# Altium schematic sheet circuit.SchDoc
size A4; SheetNumber: 1; SheetTotal: 2
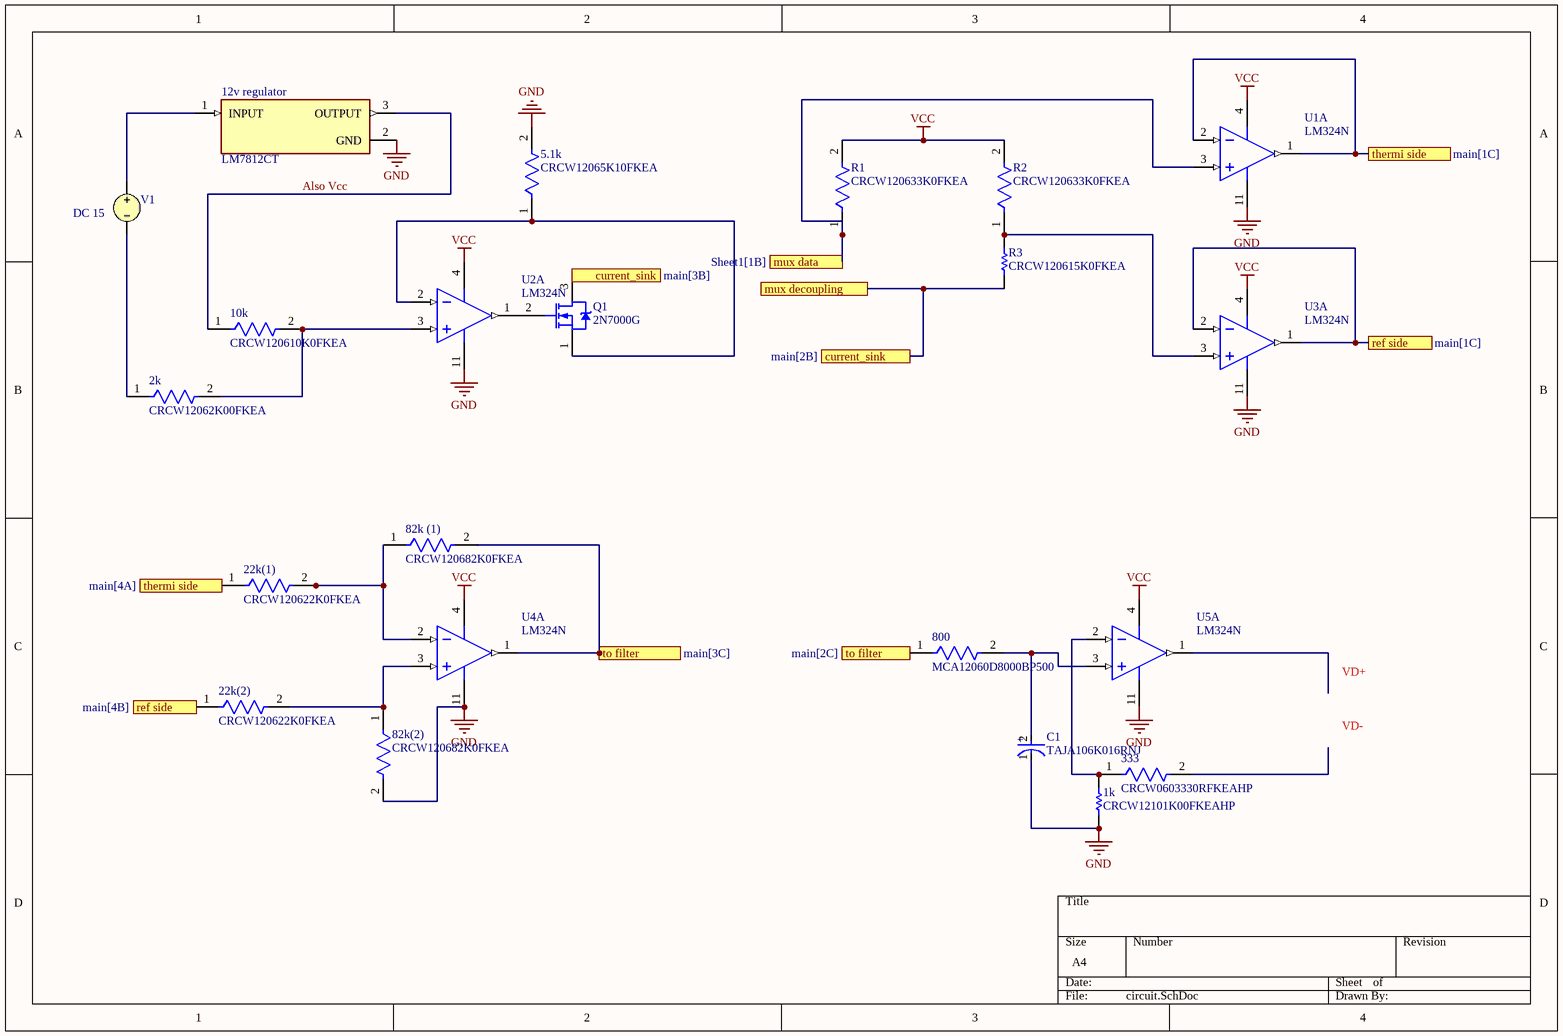
[diagram p0: circuit.SchDoc]

## Parts
1k  CRCW12101K00FKEAHP  [RESC3225X60X45NL20T20]
2k  CRCW12062K00FKEA  [FP-CRCW1206-e3-IPC_A]
5.1k  CRCW12065K10FKEA  [FP-CRCW1206-e3-IPC_C]
10k  CRCW120610K0FKEA  [FP-CRCW1206-e3-IPC_C]
12v_regulator  LM7812CT  [FP-TO220B03-MFG]
22k(1)  CRCW120622K0FKEA  [FP-CRCW1206-e3-IPC_A]
22k(2)  CRCW120622K0FKEA  [FP-CRCW1206-e3-IPC_A]
82k(2)  CRCW120682K0FKEA  [FP-CRCW1206-e3-IPC_B]
82k_(1)  CRCW120682K0FKEA  [FP-CRCW1206-e3-IPC_B]
333  CRCW0603330RFKEAHP  [FP-CRCW0603-HPe3-IPC_C]
800  MCA12060D8000BP500  [FP-MCA1206-IPC_C]
C1  TAJA106K016RNJ  [FP-TAJA-MFG]
Q1  2N7000G  [ONSC-TO-92-3-29-11]
R1  CRCW120633K0FKEA  [FP-CRCW1206-e3-IPC_B]
R2  CRCW120633K0FKEA  [FP-CRCW1206-e3-IPC_B]
R3  CRCW120615K0FKEA  [RESC3216X60X45LL10T20]
U1  LM324N  [N0014A]  (part A of 4)
U2  LM324N  [N0014A]  (part A of 4)
U3  LM324N  [N0014A]  (part A of 4)
U4  LM324N  [N0014A]  (part A of 4)
U5  LM324N  [N0014A]  (part A of 4)
V1  DC 15

## Ports
current_sink (see main[2B]), current_sink (see main[3B]), mux data (see Sheet1[1B]), mux decoupling, ref side (see main[1C]), ref side (see main[4B]), thermi side (see main[1C]), thermi side (see main[4A]), to filter (see main[2C]), to filter (see main[3C])

## Nets
GND: 1k.1 5.1k.2 12v_regulator.2(GND) 82k(2).2 C1.1(C) U1.11(GND) U2.11(GND) U3.11(GND) U4.11(GND) U5.11(GND)
VCC: R1.2 R2.2 U1.4(V+) U2.4(V+) U3.4(V+) U4.4(V+) U5.4(V+)
Also Vcc: 10k.1 12v_regulator.3(OUTPUT)
current_sink: Q1.3(D) R3.1 ; port current_sink, port mux decoupling
mux data: R1.1 U1.3(IN1+) ; port mux data
ref side: 22k(2).1 U3.1(OUT1) U3.2(IN1-) ; port ref side
thermi side: 22k(1).1 U1.1(OUT1) U1.2(IN1-) ; port thermi side
to filter: 82k_(1).2 800.1 U4.1(OUT1) ; port to filter
Net1k_2: 1k.2 333.1 U5.2(IN1-)
Net2k_1: 2k.1 V1.2
Net2k_2: 2k.2 10k.2 U2.3(IN1+)
Net5.1k_1: 5.1k.1 Q1.1(S) U2.2(IN1-)
Net12v_regulator_1: 12v_regulator.1(INPUT) V1.1
Net22k(1)_2: 22k(1).2 82k_(1).1 U4.2(IN1-)
Net22k(2)_2: 22k(2).2 82k(2).1 U4.3(IN1+)
Net800_2: 800.2 C1.2(A) U5.3(IN1+)
NetQ1_2: Q1.2(G) U2.1(OUT1)
NetR2_1: R2.1 R3.2 U3.3(IN1+)

Not connected (* = marked no-connect by the designer): 333 2; U5 1(OUT1)

## Notes on the sheet
- (in symbol CMP-1661-00004-2) +

## Library data of the parts
1k = CMP-2005-00195-1: Manufacturer: Vishay Dale; Part Number: CRCW12101K00FKEAHP
2k = CMP-1014-00542-3: RES Thick Film, 2kΩ, 1%, 0.25W, 100ppm/°C, 1206; Max Power Dissipation: 250mW; Voltage Rating: 200V; Resistance: 2kR; Package Quantity: 10; Height: 0.55mm; Tolerance: 1%; Number of Terminations: 2; Mount: Surface Mount; Width: 1.6mm; Length: 3.2mm; Features: Automotive AEC-Q200; Contact Plating: Tin; Number of Pins: 2; Weight: 0.000353oz; Max Operating Temperature: 155°C; Min Operating Temperature: -55°C; Termination: SMD/SMT; Temperature Coefficient: 100ppm/°C; Case Code (Imperial): 1206; Depth: 1.6mm; Military Standard: Not; Case Code (Metric): 3216; Composition: Thick Film; Power Rating: 250mW; Case/Package: 1206; Radiation Hardening: No; Packaging: Tape and Reel
5.1k = CMP-1014-00590-3: RES Thick Film, 5.1kΩ, 1%, 0.25W, 100ppm/°C, 1206; Voltage Rating (DC): 200V; Max Power Dissipation: 250mW; Resistance: 5.1kR; Features: Automotive AEC-Q200; Weight: 0.000353oz; Case Code (Imperial): 1206; Case/Package: 1206; Min Operating Temperature: -55°C; Max Operating Temperature: 155°C; Height: 0.55mm; Termination: SMD/SMT; Case Code (Metric): 3216; Power Rating: 250mW; Lead Free: Lead Free; Contact Plating: Tin; Tolerance: 1%; Depth: 1.6mm; Composition: Thick Film; Radiation Hardening: No; Military Standard: Not; Packaging: Tape and Reel; Width: 1.6mm; Voltage Rating: 200V; Package Quantity: 10; Temperature Coefficient: 100ppm/°C; Length: 3.2mm; Number of Terminations: 2
10k = CMP-2003-04807-2: RES Thick Film, 10kΩ, 1%, 0.25W, 100ppm/°C, 1206; Working Voltage: 200V; Max Power Dissipation: 250mW; Resistance: 10kR; Tolerance: 1%; Width: 0.063inch; Height: 0.55mm; Number of Pins: 2; Voltage Rating: 200V; Temperature Coefficient: 100ppm/°C; Military Standard: Not; Features: Automotive AEC-Q200; Depth: 1.6mm; Radiation Hardening: No; Termination: SMD/SMT; Case Code (Imperial): 1206; Weight: 0.000353oz; Length: 3.2mm; Package Quantity: 10; Voltage Rating (DC): 200V; Case/Package: 1206; Min Operating Temperature: -55°C; Number of Terminations: 2; Composition: Thick Film; Contact Plating: Tin; Power Rating: 250mW; Packaging: Tape and Reel; Max Operating Temperature: 155°C; Lead Free: Lead Free; Case Code (Metric): 3216
12v_regulator = CMP-07128-000015-1: IC REG LINEAR 12V 1A TO220-3; Obsolete Part: true; Manufacturer: ON Semiconductor; Nominal Supply Current: 5.1mA; Output Type: Fixed; Dropout Voltage: 2V; Max Supply Voltage: 35V; Accuracy Percentage: 4%; Standoff Height: 2.7mm; Number Of Outputs: 1; Octopart: https://octopart.com/lm7812ct-on+semiconductor-14383031; Output Current: 1A; ComponentLink2Description: Datasheet; Device Class L1: Integrated Circuits (ICs); Device Class L2: Power Management ICs; Temperature Range Low: -40°C; Category: IC; Package: TO220B03; Device Class L3: Voltage Regulators - Linear; RoHS: TRUE; Digikey Description: IC REG LINEAR 12V 1A TO220-3; Ipc Land Pattern Name: TO-220; Output Voltage: 12V; Temperature: -40°C to +125°C; Automotive: No; Temperature Range High: +125°C; ComponentLink2URL: https://www.mouser.in/datasheet/2/308/LM7812-1125088.pdf; Manufacturer Part Number: LM7812CT; Height: 20.4mm; Lead Free: Yes
22k(1) 22k(2) = CMP-2003-01962-2: RES Thick Film, 22kΩ, 1%, 0.25W, 100ppm/°C, 1206; Voltage Rating (DC): 200V; Resistance: 22kR; Max Power Dissipation: 250mW; Lead Free: Lead Free; Length: 3.2mm; Case Code (Imperial): 1206; Max Operating Temperature: 155°C; Packaging: Tape and Reel; Composition: Thick Film; Temperature Coefficient: 100ppm/°C; Contact Plating: Tin; Number of Terminations: 2; Case Code (Metric): 3216; Tolerance: 1%; Weight: 0.000353oz; Features: Automotive AEC-Q200; Min Operating Temperature: -55°C; Width: 0.063inch; Package Quantity: 10; Case/Package: 1206; Termination: SMD/SMT; Military Standard: Not; Depth: 1.6mm; Voltage Rating: 200V; Radiation Hardening: No; Power Rating: 250mW; Height: 0.55mm
82k(2) 82k_(1) = CMP-2003-02402-2: RES Thick Film, 82kΩ, 1%, 0.25W, 100ppm/°C, 1206; Max Power Dissipation: 250mW; Working Voltage: 200V; Resistance: 82kR; Temperature Coefficient: 100ppm/°C; Max Operating Temperature: 155°C; Depth: 1.6mm; Military Standard: Not; Case/Package: 1206; Number of Terminations: 2; Number of Pins: 2; Power Rating: 250mW; Packaging: Tape and Reel; Package Quantity: 10; Width: 0.063inch; Case Code (Imperial): 1206; Height: 0.55mm; Min Operating Temperature: -55°C; Termination: SMD/SMT; Tolerance: 1%; Voltage Rating (DC): 200V; Weight: 0.000353oz; Composition: Thick Film; Case Code (Metric): 3216; Contact Plating: Tin; Radiation Hardening: No; Lead Free: Lead Free; Voltage Rating: 200V; Features: Automotive AEC-Q200; Length: 3.2mm
333 = CMP-02407-011024-1: RES Thick Film, 330Ω, 1%, 0.33W, 100ppm/°C, 0603; Voltage Rating (DC): 75V; Resistance: 330R; Max Power Dissipation: 250mW; Length: 1.6mm; Case/Package: 0603; Depth: 0.85mm; Contact Plating: Tin; Resistor Type: Thick Film; Number of Terminations: 2; Height: 0.45mm; Radiation Hardening: No; Case Code (Imperial): 0603; Width: 0.033inch; Packaging: Tape and Reel; Weight: 7.1E-05oz; Lead Free: Lead Free; Technology: THICK FILM; Features: Automotive AEC-Q200; Resistance Tolerance: 1%; Tolerance: 1%; Termination: SMD/SMT; Max Operating Temperature: 155°C; RoHS Compliant: Yes; Mount: Surface Mount; Power Rating: 250mW; Series: CRCW-HP; Military Standard: Not; Voltage Rating: 75V; Package Quantity: 1; Temperature Coefficient: 100ppm/°C; Construction: Rectangular; Case Code (Metric): 1608; Min Operating Temperature: -55°C
800 = CMP-02407-008722-1: Res MC Precision Thin Film 1206 800Ω 0.1% 0.25W ±25ppm/°C Molded Paper T/R; Resistance: 800R; Max Power Dissipation: 250mW; Lead Free: Lead Free; Package Quantity: 5000; Composition: Thin Film; Tolerance: 0.1%; Number of Terminations: 2; Length: 0.126inch; Width: 0.063inch; Max Operating Temperature: 125°C; Packaging: Tape and Reel; Min Operating Temperature: -55°C; Case/Package: 1206; Temperature Coefficient: 25ppm/°C; Height: 0.026inch
C1 = CMP-1661-00004-2: 10uF 16V  ±10% 3Ω 1206  SMD Tantalum Capacitor; ESR (Equivalent Series Resistance): 3R; Leakage Current: 1.6uA; Dissipation Factor: 8%; Polarity: Polar; Length: 3.2mm; Features: General Purpose; Voltage Rating: 16V; Voltage: 16V; Mount: Surface Mount; Case/Package: 1206; Number of Pins: 2; Case Code (Metric): 3216; Radiation Hardening: No; Min Operating Temperature: -55°C; Case Code (Imperial): 1206; Height - Seated (Max): 0.071inch; Lead Free: Lead Free; Termination: SMD/SMT; Dielectric Material: Tantalum; Width: 1.6mm; Tolerance: 10%; Capacitance: 10uF; Lead Pitch: 1.1mm; Max Operating Temperature: 125°C; Voltage Rating (DC): 16V; Packaging: Tape and Reel; Package Quantity: 1; REACH SVHC: No SVHC; Depth: 1.6mm; Height: 1.6mm
Q1 = CMP-1058-00937-1: Small Signal MOSFET, 200 mA, 60 V, N-Channel, 3-Pin TO-92, Pb-Free, Bulk Box; Manufacturer: On Semiconductor; Coss Typ (pF): 25; ID Max (A): 0.2; Ciss Typ (pF): 60; VGS(th) Max (V): 3; PD Max (W): 0.35; Configuration: Single; Channel Polarity: N Channel; VGS Max (V): 20; Crss Typ (pF): 5; RoHS: Pb-Free; PackageVersion: Rev. AM; Mounting Technology: Through Hole; PackageReference: TO-92-3-29-11_AM_SL; ComponentLink1Description: Manufacturer URL; PartNumber: 2N7000G; Package Type: TO-92; ComponentLink3Description: Package Specification; ComponentLink2Description: Datasheet; ComponentLink3URL: http://www.onsemi.cn/pub_link/Collateral/2N6426-D.PDF; DatasheetVersion: Rev. 8; Packing: Bulk Box; PackageDescription: 3-Pin Transistor Outline, Body 4.825 x 3.685 mm, Pitch 1.27 mm; ComponentLink1URL: http://www.onsemi.com/; V(BR)DSS Min (V): 60; ComponentLink2URL: http://www.onsemi.com/pub_link/Collateral/2N7000-D.PDF
R1 R2 = CMP-2003-02103-2: RES Thick Film, 33kΩ, 1%, 0.25W, 100ppm/°C, 1206; Working Voltage: 200V; Resistance: 33kR; Power Rating: 250mW; Package Quantity: 10; Max Operating Temperature: 155°C; Height: 0.55mm; Length: 3.2mm; Lead Free: Lead Free; Contact Plating: Tin; Min Operating Temperature: -55°C; Voltage Rating (DC): 200V; Case Code (Metric): 3216; Depth: 1.6mm; Voltage Rating: 200V; Tolerance: 1%; Weight: 0.000353oz; Termination: SMD/SMT; Composition: Thick Film; Military Standard: Not; Features: Automotive AEC-Q200; Case Code (Imperial): 1206; Case/Package: 1206; Number of Terminations: 2; Packaging: Tape and Reel; Temperature Coefficient: 100ppm/°C; Width: 1.6mm; Max Power Dissipation: 250mW; Radiation Hardening: No
R3 = CMP-2003-01817-1: Manufacturer: Vishay Dale; Part Number: CRCW120615K0FKEA
U1-U5 = CMP-0055-00082-3: Low Power Quad Operational Amplifier, 14-pin MDIP; Manufacturer: Texas Instruments; CompType: Amplifiers; PowerWise: N; PackageTopMarking: NSUZXYYTTE#*LM324N; PackageDescription: MDIP, .750 x .250 x.130in, 14 Lead, .100in Pitch; Package Reference: N0014A; RoHS: N; Code_JEDEC: MS-001-AA; ComponentLink1URL: http://www.ti.com/general/docs/lit/getliterature.tsp?genericPartNumber=LM324&fileType=pdf; ComponentLink1Description: Datasheet URL; PinCount: 14
V1 = VSRC: Voltage Source; Note: PCB Footprint - Not required; AC Magnitude: 0; Value: 15; Published: 8-Jun-2000; LatestRevisionDate: 17-Jul-2002; LatestRevisionNote: Re-released for DXP Platform.; PackageReference: Not Applicable; Publisher: Altium Limited; AC Phase: 0